# Altium schematic sheet GD_supply.SchDoc
size A4
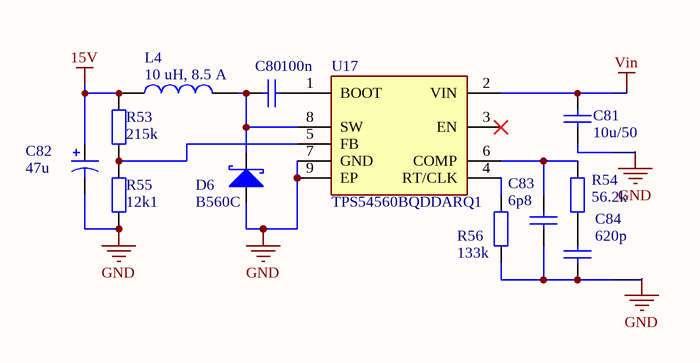
[diagram p0: GD_supply.SchDoc]

## Parts
C80  100n  [C_0603]
C81  10u/50  [C_1210]
C82  47u  [C_SMD_R8*10 Elyt]
C83  6p8  [C_0603]
C84  620p  [C_0603]
D6  B560C  [D_DO214AB-SMC]
L4  10 uH, 8.5 A  [WE-HCI_1350]
R53  215k  [R_0603]
R54  56.2k  [R_0603]
R55  12k1  [R_0603]
R56  133k  [R_0603]
U17  TPS54560BQDDARQ1  [IC_TPS54560BQDDARQ1]

## Nets
15V: C82.1 L4.2 R53.2
GND: C81.1 C82.2 C83.1 C84.1 D6.2(A) R55.1 R56.1 U17.7(GND) U17.9(EP)
Vin: C81.2 U17.2(VIN)
NetC80_1: C80.1 D6.1(K) L4.1 U17.8(SW)
NetC80_2: C80.2 U17.1(BOOT)
NetC83_2: C83.2 R54.2 U17.6(COMP)
NetC84_2: C84.2 R54.1
NetR53_1: R53.1 R55.2 U17.5(FB)
NetR56_2: R56.2 U17.4(RT/CLK)

Not connected (* = marked no-connect by the designer): U17 3(EN)*

## Library data of the parts
C80 C81 C83 C84 = C_MLCC: cond; ClassName: DcDc15
  C80: Value: 100n
  C81: Value: 10u/50
  C83: Value: 6p8
  C84: Value: 620p
C82 = C_Elyt: Polarized Capacitor; Value: 47u
D6 = D_Schottky: Schottky Diode; ClassName: DcDc15
L4 = 7443550101: SMT Flat Wire High Current Inductor WE-HCI, size 1350, 10 uH, 8.5 A; Rated Current: 8.5 A; Inductance: 10 uH; DC Resistance max.: 15.51 mOhm; Self Resonant Frequency: 18 MHz; Saturation Current: 10 A; Material: WE-PERM; Rated Inductance: 7.8 uH; ComponentLink1Description: Manufacturer; ComponentLink1URL: http://www.we-online.de; ComponentLink2Description: Datasheet; ComponentLink2URL: https://katalog.we-online.com/pbs/datasheet/7443550101.pdf; Part Number: 7443550101; Published Date: December 2018; Publisher: Wurth Elektronik; Size: 1350; Operating Temperature: -40 to +155 degC; Mounting Technology: SMT; Packaging: Tape and Reel; ClassName: DcDc15
R53-R56 = R_Uni: Resistor; ClassName: DcDc15
  R53: Value: 215k
  R54: Value: 56.2k
  R55: Value: 12k1
  R56: Value: 133k
U17 = IC_TPS54560BQDDARQ1: 4.5 V to 60 V Input, 5 A, Step Down DC-DC Converter; ComponentLink1Description: Datasheet; ComponentLink1URL: http://www.ti.com/lit/ds/symlink/tps54560b-q1.pdf; ClassName: DcDc15